# Altium project PCB_Project_MyTectra.PrjPcb
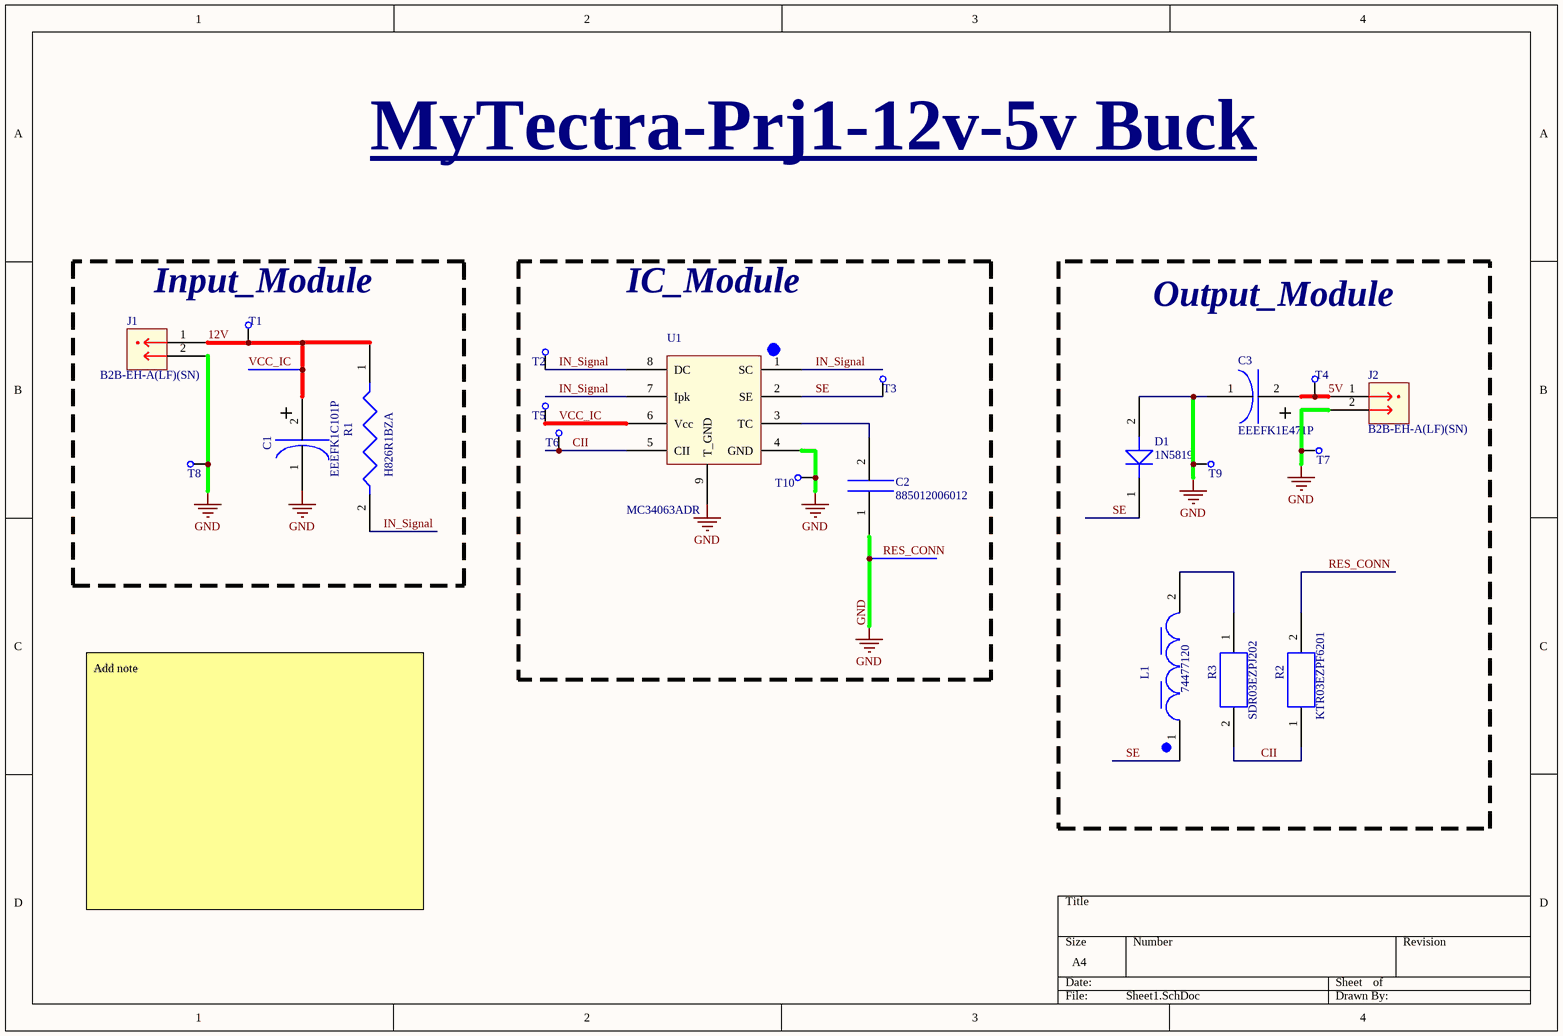
[diagram p0: Sheet1.SchDoc]
1 sheet, 21 parts. Net scope: global (net labels, ports and power ports of the same name join across sheets).
Board files: PCB1.PcbDoc, PCB_Panel.PcbDoc, PCB_Test.PcbDoc

## Sheet Sheet1.SchDoc
size A4; SheetNumber: 1; SheetTotal: 1

### Parts
C1  EEEFK1C101P  [EEE-FK1C101P]
C2  885012006012  [885012006012]
C3  EEEFK1E471P  [EEE-FK1E471P]
D1  1N5819  [1N5819]
J1  B2B-EH-A(LF)(SN)  [B2B-EH-A(LF)(SN)]
J2  B2B-EH-A(LF)(SN)  [B2B-EH-A(LF)(SN)]
L1  74477120  [74477120_Inductor]
R1  H826R1BZA  [H826R1BZA]
R2  KTR03EZPF6201  [KTR03EZPF6201]
R3  SDR03EZPJ202  [SDR03EZPJ202]
T1  Test Pad  [Test Point]  (value not drawn)
T2  Test Pad  [Test Point]  (value not drawn)
T3  Test Pad  [Test Point]  (value not drawn)
T4  Test Pad  [Test Point]  (value not drawn)
T5  Test Pad  [Test Point]  (value not drawn)
T6  Test Pad  [Test Point]  (value not drawn)
T7  Test Pad  [Test Point]  (value not drawn)
T8  Test Pad  [Test Point]  (value not drawn)
T9  Test Pad  [Test Point]  (value not drawn)
T10  Test Pad  [Test Point]  (value not drawn)
U1  MC34063ADR  [MC34063ADR]

### Blocks framed on the sheet
Input_Module: C1 J1 R1 T1 T8
IC_Module: C2 T2 T3 T5 T6 T10 U1
Output_Module: C3 D1 J2 L1 R2 R3 T4 T7 T9

### Nets
GND: C1.1 C2.1 C3.1 D1.2 J1.2 J2.2 R2.2 T7.1 T8.1 T9.1 T10.1 U1.4(GND) U1.9(T_GND)  [also labelled RES_CONN]
5V: C3.2 J2.1 T4.1
12V: C1.2 J1.1 R1.1 T1.1 T5.1 U1.6(Vcc)  [also labelled VCC_IC]
CII: R2.1 R3.2 T6.1 U1.5(CII)
IN_Signal: R1.2 T2.1 U1.1(SC) U1.7(Ipk) U1.8(DC)
SE: D1.1 L1.1 T3.1 U1.2(SE)
NetC2_2: C2.2 U1.3(TC)
NetL1_2: L1.2 R3.1

### Notes on the sheet
- MyTectra-Prj1-12v-5v Buck
- Add note

### Library data of the parts
C1 = EEEFK1C101P: Cap Aluminum 100uF 16V 20% (6.3 X 5.8mm) SMD 240mA 2000 hr 105°C T/R; Manufacturer: Panasonic; Supplier: Mouser; Supplier Part Number: 667-EEE-FK1C101P; Manufacturer Part Number: EEEFK1C101P; RoHS: Yes; Category: Aluminum Electrolytic Capacitors; Stock: 76012; Pricing: 1=0.45, 10=0.243, 50=0.243, 100=0.211, 1000=0.125, 10000=0.106 (USD); ComponentLink1URL: https://datasheet.ciiva.com/19479/1357482-19479360.pdf?src-supplier=Jameco; ComponentLink1Description: https://datasheet.ciiva.com/19479/1357482-19479360.pdf?src-supplier=Jameco; ComponentLink2URL: https://datasheet.ciiva.com/11777/0900766b80e4e8b0-11777237.pdf?src-supplier=Rs; ComponentLink2Description: https://datasheet.ciiva.com/11777/0900766b80e4e8b0-11777237.pdf?src-supplier=Rs; ComponentLink3URL: https://datasheet.ciiva.com/29313/443464-da-01-en-smd-elko-vfk-d-100-uf-16v-29313488.pdf?src-supplier=Conrad; ComponentLink3Description: https://datasheet.ciiva.com/29313/443464-da-01-en-smd-elko-vfk-d-100-uf-16v-29313488.pdf?src-supplier=Conrad; ComponentLink4URL: https://datasheet.ciiva.com/16449/aba0000ce120-16449534.pdf?src-supplier=Future+Electronics; ComponentLink4Description: https://datasheet.ciiva.com/16449/aba0000ce120-16449534.pdf?src-supplier=Future+Electronics; ComponentLink5URL: https://datasheet.ciiva.com/24022/aba0000ce120-24022554.pdf?src-supplier=Mouser; ComponentLink5Description: https://datasheet.ciiva.com/24022/aba0000ce120-24022554.pdf?src-supplier=Mouser; ComponentLink6URL: https://datasheet.ciiva.com/43463/58258-43463495.pdf?src-supplier=Farnell; ComponentLink6Description: https://datasheet.ciiva.com/43463/58258-43463495.pdf?src-supplier=Farnell; ComponentLink7URL: https://datasheet.ciiva.com/2983/aba0000ce120-2983939.pdf?src-supplier=Avnet; ComponentLink7Description: https://datasheet.ciiva.com/2983/aba0000ce120-2983939.pdf?src-supplier=Avnet; ComponentLink8URL: https://datasheet.ciiva.com/30177/aba0000ce120-30177788.pdf?src-supplier=Onlinecomponents.com; ComponentLink8Description: https://datasheet.ciiva.com/30177/aba0000ce120-30177788.pdf?src-supplier=Onlinecomponents.com; ComponentLink9URL: https://datasheet.ciiva.com/14601/70255214-14601005.pdf?src-supplier=Allied+Electronics; ComponentLink9Description: https://datasheet.ciiva.com/14601/70255214-14601005.pdf?src-supplier=Allied+Electronics; ComponentLink10URL: https://datasheet.ciiva.com/46387/1676921-46387918.pdf?src-supplier=Element14; ComponentLink10Description: https://datasheet.ciiva.com/46387/1676921-46387918.pdf?src-supplier=Element14; ComponentLink11URL: https://datasheet.ciiva.com/46376/1676921-46376425.pdf?src-supplier=Element14; ComponentLink11Description: https://datasheet.ciiva.com/46376/1676921-46376425.pdf?src-supplier=Element14
C2 = 885012006012: Ceramic Capacitor 470pF, 10VDC, 0603, ±5 %; Manufacturer: Wurth Electronics; Supplier: Digi-Key; Supplier Part Number: 732-7756-1-ND; Manufacturer Part Number: 885012006012; RoHS: Yes; Category: Ceramic Capacitors; Stock: 15812; Pricing: 1=0.1, 10=0.044, 100=0.039, 500=0.035 (USD); ComponentLink1URL: http://www.farnell.com/datasheets/2546579.pdf?src-supplier=Farnell; ComponentLink1Description: http://www.farnell.com/datasheets/2546579.pdf?src-supplier=Farnell; ComponentLink2URL: https://katalog.we-online.de/pbs/datasheet/885012006012.pdf?src-supplier=Digi-Key; ComponentLink2Description: https://katalog.we-online.de/pbs/datasheet/885012006012.pdf?src-supplier=Digi-Key; ComponentLink3URL: http://www.farnell.com/datasheets/2546579.pdf?src-supplier=Newark; ComponentLink3Description: http://www.farnell.com/datasheets/2546579.pdf?src-supplier=Newark
C3 = EEEFK1E471P: CAP ALUM 470UF 20% 25V SMD; Manufacturer: Panasonic; Supplier: Mouser; Supplier Part Number: 667-EEE-FK1E471P; Manufacturer Part Number: EEEFK1E471P; RoHS: Yes; Category: Aluminum Electrolytic Capacitors; Stock: 24677; Pricing: 1=0.97, 10=0.67, 50=0.67, 100=0.505, 1000=0.328, 10000=0.318 (USD); ComponentLink1URL: https://datasheet.ciiva.com/11777/0900766b80e4e8b0-11777352.pdf?src-supplier=Rs; ComponentLink1Description: https://datasheet.ciiva.com/11777/0900766b80e4e8b0-11777352.pdf?src-supplier=Rs; ComponentLink2URL: https://datasheet.ciiva.com/29313/443472-da-01-en-smd-elko-vfk-g-470-uf-25v-29313562.pdf?src-supplier=Conrad; ComponentLink2Description: https://datasheet.ciiva.com/29313/443472-da-01-en-smd-elko-vfk-g-470-uf-25v-29313562.pdf?src-supplier=Conrad; ComponentLink3URL: https://datasheet.ciiva.com/46376/1676921-46376477.pdf?src-supplier=Element14; ComponentLink3Description: https://datasheet.ciiva.com/46376/1676921-46376477.pdf?src-supplier=Element14; ComponentLink4URL: https://datasheet.ciiva.com/46381/1676921-46381499.pdf?src-supplier=Element14; ComponentLink4Description: https://datasheet.ciiva.com/46381/1676921-46381499.pdf?src-supplier=Element14; ComponentLink5URL: https://datasheet.ciiva.com/46381/58258-46381500.pdf?src-supplier=Element14; ComponentLink5Description: https://datasheet.ciiva.com/46381/58258-46381500.pdf?src-supplier=Element14; ComponentLink6URL: https://datasheet.ciiva.com/16432/aba0000ce120-16432909.pdf?src-supplier=Future+Electronics; ComponentLink6Description: https://datasheet.ciiva.com/16432/aba0000ce120-16432909.pdf?src-supplier=Future+Electronics
D1 = 1N5819: 1N5819 Series Low Drop Power 1 A 40 V Schottky Rectifier Through Hole - DO-41; Manufacturer: Taiwan Semiconductor; Supplier: Digi-Key; Supplier Part Number: 1801-1N5819CT-ND; Manufacturer Part Number: 1N5819; RoHS: Yes; Category: Schottky Diodes; Stock: 2706; Pricing: 1=0.49, 10=0.399, 100=0.2719, 500=0.20392, 1000=0.15294, 2000=0.1402 (USD); ComponentLink1URL: https://datasheet.ciiva.com/26338/155370-da-01-en-schottky-diode-1-n-5819-tsc-do-41-26338776.pdf?src-supplier=Conrad; ComponentLink1Description: https://datasheet.ciiva.com/26338/155370-da-01-en-schottky-diode-1-n-5819-tsc-do-41-26338776.pdf?src-supplier=Conrad; ComponentLink2URL: https://datasheet.ciiva.com/26309/ql600260-600262-e-26309355.pdf?src-supplier=Distrelec; ComponentLink2Description: https://datasheet.ciiva.com/26309/ql600260-600262-e-26309355.pdf?src-supplier=Distrelec; ComponentLink3URL: https://datasheet.ciiva.com/24491/1n581720series-c10-24491580.pdf?src-supplier=Onlinecomponents.com; ComponentLink3Description: https://datasheet.ciiva.com/24491/1n581720series-c10-24491580.pdf?src-supplier=Onlinecomponents.com
J1 J2 = B2B-EH-A(LF)(SN): CONN HEADER EH TOP 2POS 2.5MM; Manufacturer: JST; Supplier: Arrow Electronics; Supplier Part Number: B2B-EH-A(LF)(SN); Manufacturer Part Number: B2B-EH-A(LF)(SN); RoHS: Yes; Category: Headers and Wire Housings; Stock: 19411; Pricing: 1=0.1297, 10=0.0976, 25=0.0965, 50=0.0955, 100=0.0702, 500=0.0452 (USD); ComponentLink1URL: https://datasheet.ciiva.com/26924/getdatasheetpartid-639961-26924027.pdf?src-supplier=Verical; ComponentLink1Description: https://datasheet.ciiva.com/26924/getdatasheetpartid-639961-26924027.pdf?src-supplier=Verical; ComponentLink2URL: https://datasheet.ciiva.com/11746/0900766b805aab1f-11746167.pdf?src-supplier=Rs; ComponentLink2Description: https://datasheet.ciiva.com/11746/0900766b805aab1f-11746167.pdf?src-supplier=Rs; ComponentLink3URL: https://datasheet.ciiva.com/41451/001217319-da-01-en-stiftleiste-gerade-2-pol-rm-25mm-41451366.pdf?src-supplier=Conrad; ComponentLink3Description: https://datasheet.ciiva.com/41451/001217319-da-01-en-stiftleiste-gerade-2-pol-rm-25mm-41451366.pdf?src-supplier=Conrad; ComponentLink4URL: https://datasheet.ciiva.com/712/eeh-712441.pdf?src-supplier=Digi-Key; ComponentLink4Description: https://datasheet.ciiva.com/712/eeh-712441.pdf?src-supplier=Digi-Key; ComponentLink5URL: https://datasheet.ciiva.com/16449/b2b-eh-alfsn-16449468.pdf?src-supplier=Future+Electronics; ComponentLink5Description: https://datasheet.ciiva.com/16449/b2b-eh-alfsn-16449468.pdf?src-supplier=Future+Electronics
L1 = 74477120: Power Choke Shielded Wirewound 100uH 20% 1KHz Ferrite 1.53A 160mOhm DCR T/R; Manufacturer: Wurth Electronics; Supplier: Rs; Supplier Part Number: 3338500P; Manufacturer Part Number: 74477120; RoHS: Yes; Category: Fixed Inductors; Stock: 1; ComponentLink1URL: https://datasheet.ciiva.com/1052/74477120-1052278.pdf?src-supplier=Digi-Key; ComponentLink1Description: https://datasheet.ciiva.com/1052/74477120-1052278.pdf?src-supplier=Digi-Key; ComponentLink2URL: https://datasheet.ciiva.com/4954/74477120-29022-4954590.pdf?src-supplier=Mouser; ComponentLink2Description: https://datasheet.ciiva.com/4954/74477120-29022-4954590.pdf?src-supplier=Mouser; ComponentLink3URL: https://datasheet.ciiva.com/11799/0900766b80bbd134-11799893.pdf?src-supplier=Rs; ComponentLink3Description: https://datasheet.ciiva.com/11799/0900766b80bbd134-11799893.pdf?src-supplier=Rs; ComponentLink4URL: https://datasheet.ciiva.com/1052/74477120-1052279.pdf?src-supplier=Digi-Key; ComponentLink4Description: https://datasheet.ciiva.com/1052/74477120-1052279.pdf?src-supplier=Digi-Key; ComponentLink5URL: https://datasheet.ciiva.com/1052/74477120-1052280.pdf?src-supplier=Digi-Key; ComponentLink5Description: https://datasheet.ciiva.com/1052/74477120-1052280.pdf?src-supplier=Digi-Key; ComponentLink6URL: https://datasheet.ciiva.com/26308/rl74477120-data-de-26308263.pdf?src-supplier=Distrelec; ComponentLink6Description: https://datasheet.ciiva.com/26308/rl74477120-data-de-26308263.pdf?src-supplier=Distrelec; ComponentLink7URL: https://datasheet.ciiva.com/48691/001087759-da-01-ml-we-pd-smd-speicherdrossel-74477120-de-en-48691212.pdf?src-supplier=Conrad; ComponentLink7Description: https://datasheet.ciiva.com/48691/001087759-da-01-ml-we-pd-smd-speicherdrossel-74477120-de-en-48691212.pdf?src-supplier=Conrad
R1 = H826R1BZA: Metal Film Resistors - Through Hole H8 26R1 0.1% 100PPM; Manufacturer: TE Connectivity; Value: 26.1R; Power Rating: 250mW; Temperature Coefficient: 100ppm/°C; Number of Resistors: 1; Voltage Rating: 350V; Supplier: Digi-Key; Supplier Part Number: H826R1BZA-ND; Manufacturer Part Number: H826R1BZA; RoHS: Yes; Category: Uncategorized; Pricing: 500=0.61476 (USD); Mounting Technology: Axial; Case/Package: Axial; Weight: 0.008466oz; Min Operating Temperature: -55°C; Max Operating Temperature: 155°C; Tolerance: 0.1%; Package Quantity: 250; Termination: Axial; Packaging: Bulk; Resistor Type: Thin Film; Number of Terminations: 2; Series: Holco, Holsworthy; Max Power Dissipation: 250mW; Diameter: 2.5mm; Length: 7.2mm; ELV: Compliant; RoHS Compliant: Yes; ComponentLink1URL: https://datasheet.ciiva.com/12654/eng-ds-1773230-g-12654485.pdf?src-supplier=Mouser; ComponentLink1Description: https://datasheet.ciiva.com/12654/eng-ds-1773230-g-12654485.pdf?src-supplier=Mouser
R2 = KTR03EZPF6201: Res High Voltage 0603 6.2K Ohm 1/10W 1% SMD; Manufacturer: Rohm; Value: 6.2kR; Max Power Dissipation: 100mW; Temperature Coefficient: 100ppm/°C; Supplier: Digi-Key; Supplier Part Number: RHM6.2KAYCT-ND; Manufacturer Part Number: KTR03EZPF6201; RoHS: Yes; Category: Chip SMD Resistors; Stock: 7098; Pricing: 1=0.16, 10=0.133, 50=0.0702, 100=0.0521, 500=0.03152, 1000=0.02182 (USD); Case/Package: 0603; Case Code (Metric): 1608; Case Code (Imperial): 0603; Min Operating Temperature: -55°C; Max Operating Temperature: 155°C; Packaging: Cut Tape; Tolerance: 1%; Number of Terminations: 2; Features: Automotive AEC-Q200; Series: KTR; Ratings: AEC-Q200; RoHS Compliant: Yes; ComponentLink1URL: https://datasheet.ciiva.com/14928/ktr-14928509.pdf?src-supplier=Digi-Key; ComponentLink1Description: https://datasheet.ciiva.com/14928/ktr-14928509.pdf?src-supplier=Digi-Key; ComponentLink2URL: https://datasheet.ciiva.com/14930/ktr-14930279.pdf?src-supplier=Digi-Key; ComponentLink2Description: https://datasheet.ciiva.com/14930/ktr-14930279.pdf?src-supplier=Digi-Key; ComponentLink3URL: https://datasheet.ciiva.com/14924/ktr-14924957.pdf?src-supplier=Digi-Key; ComponentLink3Description: https://datasheet.ciiva.com/14924/ktr-14924957.pdf?src-supplier=Digi-Key
R3 = SDR03EZPJ202: Res Thick Film 0603 2K Ohm 5% 0.3W ±200ppm/C Pad SMD Automotive T/R; Manufacturer: Rohm; Supplier: Digi-Key; Supplier Part Number: 511-1749-1-ND; Manufacturer Part Number: SDR03EZPJ202; RoHS: Yes; Category: Chip SMD Resistors; Stock: 27252; Pricing: 1=0.1, 10=0.092, 50=0.0494, 100=0.0354, 500=0.02192, 1000=0.01555 (USD); RoHS Compliant: Yes; ComponentLink1URL: https://www.rohm.com/datasheet/SDR03EZPJ/sdr-e?src-supplier=Digi-Key; ComponentLink1Description: https://www.rohm.com/datasheet/SDR03EZPJ/sdr-e?src-supplier=Digi-Key
T1-T10 = Test_Pad
U1 = MC34063ADR: Buck, Boost Switching Regulator IC Positive or Negative Adjustable 1.25V 1 Output 1.5A (Switch) 8-SOIC (0.154, 3.90mm Width); Manufacturer: Texas Instruments; Supplier: Mouser; Supplier Part Number: 595-MC34063ADR; Manufacturer Part Number: MC34063ADR; RoHS: Yes; Category: Voltage Regulators - Switching; Stock: 38934; Pricing: 1=0.71, 10=0.591, 50=0.591, 100=0.448, 1000=0.305, 10000=0.247 (USD); ComponentLink1URL: https://datasheet.ciiva.com/7408/1862376-7408060.pdf?src-supplier=Newark; ComponentLink1Description: https://datasheet.ciiva.com/7408/1862376-7408060.pdf?src-supplier=Newark; ComponentLink2URL: https://datasheet.ciiva.com/2025/mc33063a-2025161.pdf?src-supplier=Digi-Key; ComponentLink2Description: https://datasheet.ciiva.com/2025/mc33063a-2025161.pdf?src-supplier=Digi-Key; ComponentLink3URL: https://datasheet.ciiva.com/2025/mc33063a-2025162.pdf?src-supplier=Digi-Key; ComponentLink3Description: https://datasheet.ciiva.com/2025/mc33063a-2025162.pdf?src-supplier=Digi-Key; ComponentLink4URL: https://datasheet.ciiva.com/2025/mc33063a-2025163.pdf?src-supplier=Digi-Key; ComponentLink4Description: https://datasheet.ciiva.com/2025/mc33063a-2025163.pdf?src-supplier=Digi-Key